# Altium schematic sheet Audio_SCHEMATIC.SchDoc
size A4; SheetNumber: 5; SheetTotal: 5
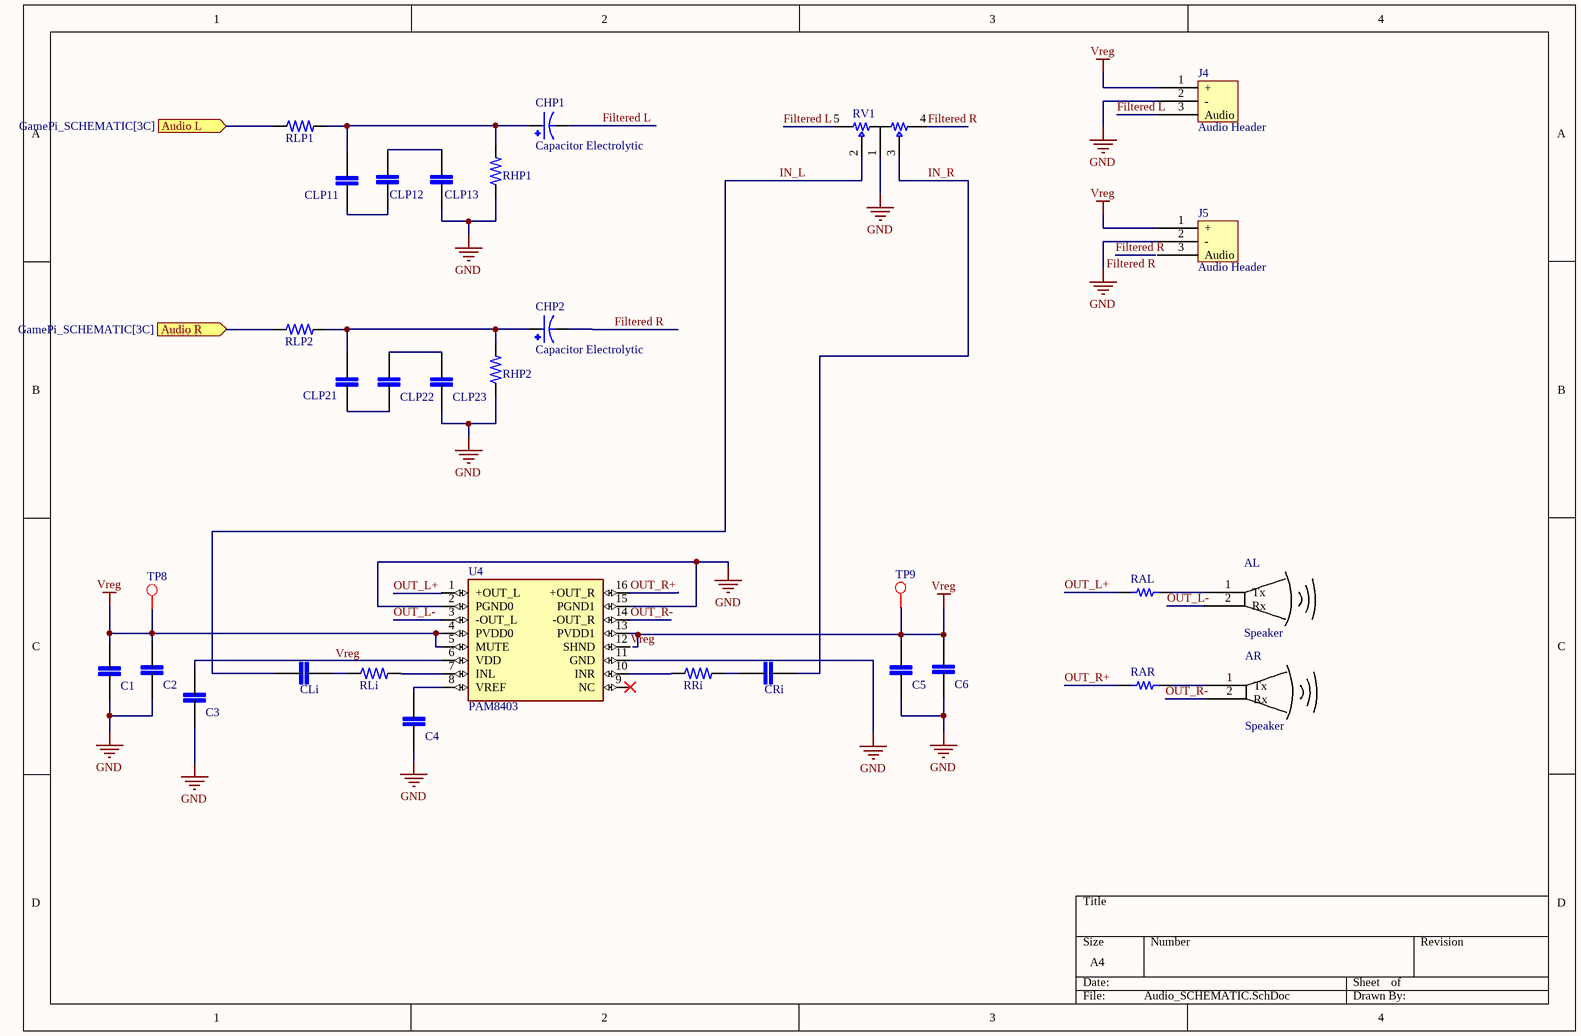
[diagram p0: Audio_SCHEMATIC.SchDoc]

## Parts
AL  Speaker  [Speaker]
AR  Speaker  [Speaker]
C1  0805  [Capacitor 0805]  (value not drawn)
C2  0805  [Capacitor 0805]  (value not drawn)
C3  0805  [Capacitor 0805]  (value not drawn)
C4  0805  [Capacitor 0805]  (value not drawn)
C5  0805  [Capacitor 0805]  (value not drawn)
C6  0805  [Capacitor 0805]  (value not drawn)
CHP1  Capacitor Electrolytic  [Capacitor Electrolytic]
CHP2  Capacitor Electrolytic  [Capacitor Electrolytic]
CLi  0805  [Capacitor 0805]  (value not drawn)
CLP11  0805  [Capacitor 0805]  (value not drawn)
CLP12  0805  [Capacitor 0805]  (value not drawn)
CLP13  0805  [Capacitor 0805]  (value not drawn)
CLP21  0805  [Capacitor 0805]  (value not drawn)
CLP22  0805  [Capacitor 0805]  (value not drawn)
CLP23  0805  [Capacitor 0805]  (value not drawn)
CRi  0805  [Capacitor 0805]  (value not drawn)
J4  Audio Header  [Audio Header]
J5  Audio Header  [Audio Header]
RAL  Resistor Axial  [Resistor Axial]  (value not drawn)
RAR  Resistor Axial  [Resistor Axial]  (value not drawn)
RHP1  0805  [Resistor 0805]  (value not drawn)
RHP2  0805  [Resistor 0805]  (value not drawn)
RLi  0805  [Resistor 0805]  (value not drawn)
RLP1  0805  [Resistor 0805]  (value not drawn)
RLP2  0805  [Resistor 0805]  (value not drawn)
RRi  0805  [Resistor 0805]  (value not drawn)
RV1  B103 Potentiometer Wheel  [B103 Pot Wheel]  (value not drawn)
TP8  Test Point  [Test Point]  (value not drawn)
TP9  Test Point  [Test Point]  (value not drawn)
U4  PAM8403  [PAM8403]

## Ports
Audio L (in, see GamePi_SCHEMATIC[3C]), Audio R (in, see GamePi_SCHEMATIC[3C])

## Nets
GND: C1.1 C2.1 C3.1 C4.1 C5.1 C6.1 CLP13.1 CLP23.1 J4.2(-) J5.2(-) RHP1.1 RHP2.1 RV1.1 U4.2(PGND0) U4.11(GND) U4.15(PGND1)
Vreg: C1.2 C2.2 C5.2 C6.2 J4.1(+) J5.1(+) TP8.TP?(Test_Point) TP9.TP?(Test_Point) U4.4(PVDD0) U4.5(MUTE) U4.12(SHND) U4.13(PVDD1)
Audio L: RLP1.1 ; port Audio L
Audio R: RLP2.1 ; port Audio R
Filtered L: CHP1.N J4.3(Audio) RV1.5
Filtered R: CHP2.N J5.3(Audio) RV1.4
IN_L: CLi.1 RV1.2
IN_R: CRi.2 RV1.3
OUT_L+: RAL.1 U4.1(+OUT_L)
OUT_L-: AL.2(Rx) U4.3(-OUT_L)
OUT_R+: RAR.1 U4.16(+OUT_R)
OUT_R-: AR.2(Rx) U4.14(-OUT_R)
NetAL_1: AL.1(Tx) RAL.2
NetAR_1: AR.1(Tx) RAR.2
NetC3_2: C3.2 U4.6(VDD)
NetC4_2: C4.2 U4.8(VREF)
NetCHP1_P: CHP1.P CLP11.2 RHP1.2 RLP1.2
NetCHP2_P: CHP2.P CLP21.2 RHP2.2 RLP2.2
NetCLi_2: CLi.2 RLi.1
NetCLP11_1: CLP11.1 CLP12.1
NetCLP12_2: CLP12.2 CLP13.2
NetCLP21_1: CLP21.1 CLP22.1
NetCLP22_2: CLP22.2 CLP23.2
NetCRi_1: CRi.1 RRi.2
NetRLi_2: RLi.2 U4.7(INL)
NetRRi_1: RRi.1 U4.10(INR)

Not connected (* = marked no-connect by the designer): U4 9(NC)*

## Notes on the sheet
- Labels drawn without touching a wire or pin: Vreg

## Library data of the parts
C1-C6 CLi CLP11-CLP13 CLP21-CLP23 CRi = Capacitor 0805
RHP1 RHP2 RLi RLP1 RLP2 RRi = Resistor 0805